# Altium schematic sheet BMS_Balancer.SchDoc
size A4
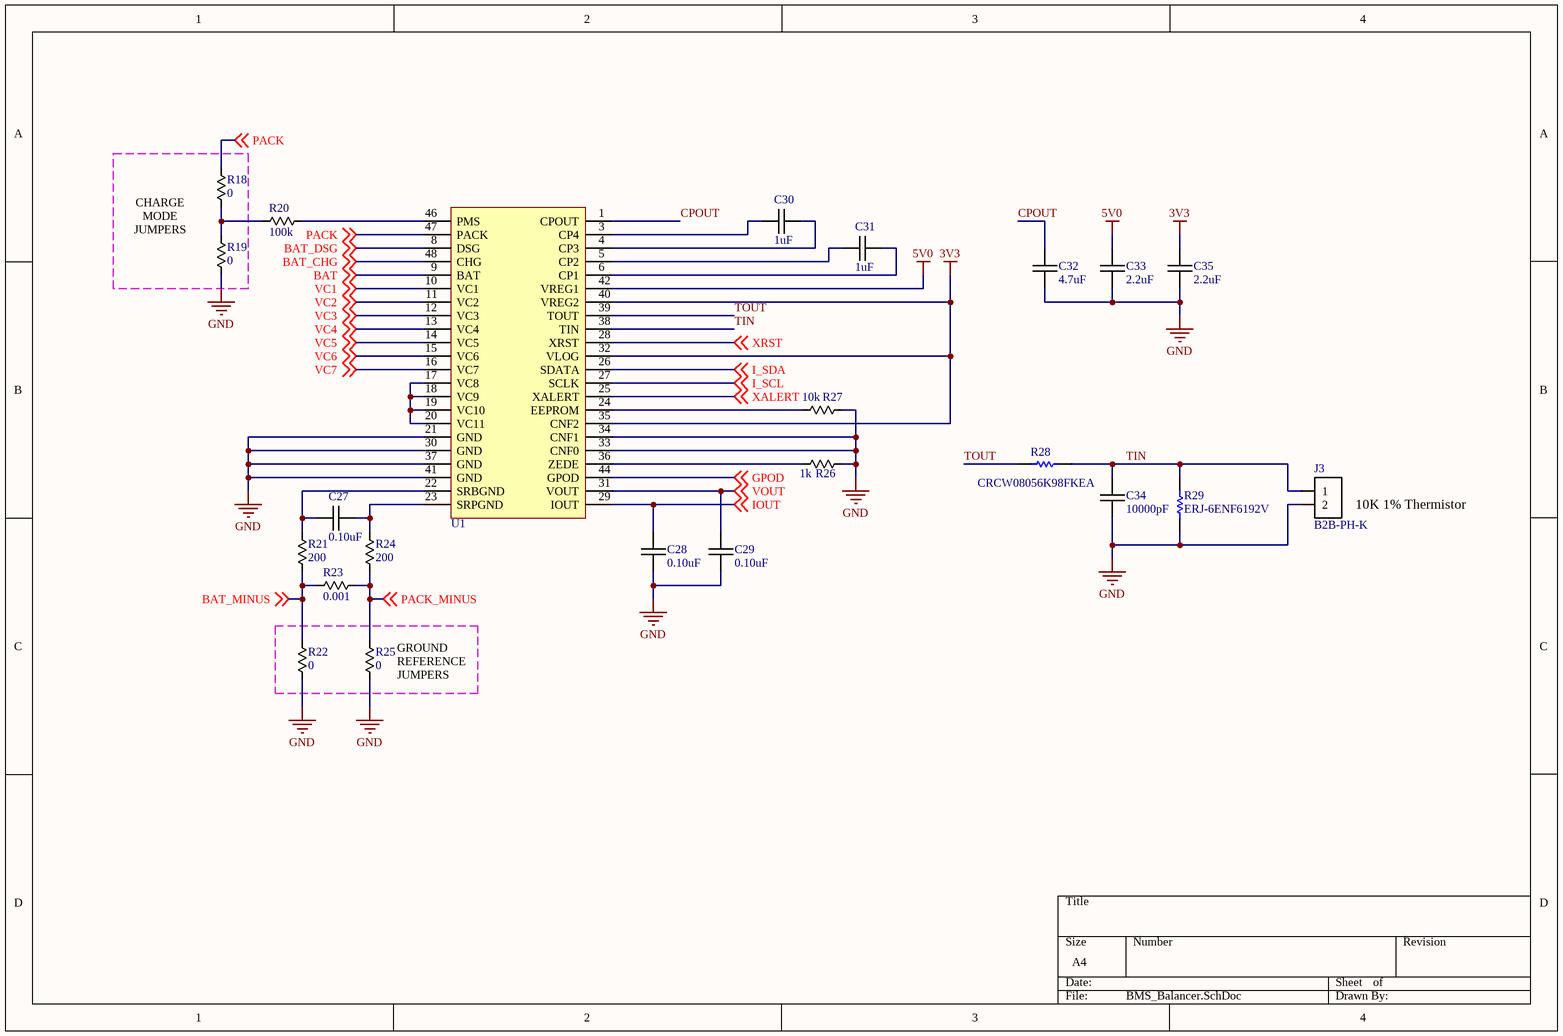
[diagram p0: BMS_Balancer.SchDoc]

## Parts
C27  0.10uF  [chip_0805]
C28  0.10uF  [chip_0805]
C29  0.10uF  [chip_0805]
C30  1uF  [chip_0805]
C31  1uF  [chip_0805]
C32  4.7uF  [chip_0805]
C33  2.2uF  [chip_1210]
C34  10000pF  [chip_0805]
C35  2.2uF  [chip_1210]
J3  B2B-PH-K  [JST_PHR_2_0]
R18  0  [chip_0805]
R19  0  [chip_0805]
R20  100k  [chip_0805]
R21  200  [chip_0805]
R22  0  [chip_0805]
R23  0.001  [chip_2512]
R24  200  [chip_0805]
R25  0  [chip_0805]
R26  1k  [chip_0805]
R27  10k  [chip_0805]
R28  CRCW08056K98FKEA  [RESC2013X50X30ML20T20]
R29  ERJ-6ENF6192V  [RESC2013X70X40ML20T20]
U1  BQ77PL900  [SSOP-48_0]  (value not drawn)

## Nets
3V3: C35.1 U1.32(VLOG) U1.35(CNF2) U1.40(VREG2)
5V0: C33.1 U1.42(VREG1)
GND: C28.2 C29.2 C32.1 C33.2 C34.2 C35.2 J3.2 R19.2 R22.2 R25.2 R26.2 R27.2 R29.1 U1.21(GND) U1.30(GND) U1.33(CNF0) U1.34(CNF1) U1.37(GND) U1.41(GND)
BAT: U1.9(BAT) ; off-sheet BAT
BAT_CHG: U1.48(CHG) ; off-sheet BAT_CHG
BAT_DSG: U1.8(DSG) ; off-sheet BAT_DSG
BAT_MINUS: R21.2 R22.1 R23.2 ; off-sheet BAT_MINUS
CPOUT: C32.2 U1.1(CPOUT)
GPOD: U1.44(GPOD) ; off-sheet GPOD
I_SCL: U1.27(SCLK) ; off-sheet I_SCL
I_SDA: U1.26(SDATA) ; off-sheet I_SDA
IOUT: C28.1 U1.29(IOUT) ; off-sheet IOUT
PACK: R18.1 U1.47(PACK) ; off-sheet PACK
PACK_MINUS: R23.1 R24.2 R25.1 ; off-sheet PACK_MINUS
TIN: C34.1 J3.1 R28.1 R29.2 U1.38(TIN)
TOUT: R28.2 U1.39(TOUT)
VC1: U1.10(VC1) ; off-sheet VC1
VC2: U1.11(VC2) ; off-sheet VC2
VC3: U1.12(VC3) ; off-sheet VC3
VC4: U1.13(VC4) ; off-sheet VC4
VC5: U1.14(VC5) ; off-sheet VC5
VC6: U1.15(VC6) ; off-sheet VC6
VC7: U1.16(VC7) ; off-sheet VC7
VOUT: C29.1 U1.31(VOUT) ; off-sheet VOUT
XALERT: U1.25(XALERT) ; off-sheet XALERT
XRST: U1.28(XRST) ; off-sheet XRST
NetC27_1: C27.1 R21.1 U1.22(SRBGND)
NetC27_2: C27.2 R24.1 U1.23(SRPGND)
NetC30_1: C30.1 U1.4(CP3)
NetC30_2: C30.2 U1.3(CP4)
NetC31_1: C31.1 U1.6(CP1)
NetC31_2: C31.2 U1.5(CP2)
NetR18_2: R18.2 R19.1 R20.1
NetR20_2: R20.2 U1.46(PMS)
NetR26_1: R26.1 U1.36(ZEDE)
NetR27_1: R27.1 U1.24(EEPROM)
NetU1_17: U1.17(VC8) U1.18(VC9) U1.19(VC10) U1.20(VC11)

Not connected (* = marked no-connect by the designer): U1 2(NC) 7(NC) 43(NC) 45(NC)

## Notes on the sheet
- CHARGE
  MODE
  JUMPERS
- (near J3) 10K 1% Thermistor
- (near R25) GROUND
  REFERENCE
  JUMPERS

## Library data of the parts
C27-C29 = CAP-00072: CAP, 0.10uF, 10%, 50V, X7R, 0805; Manufacturer: Murata; Manufacturer PN: GRM21BR71H104KA01K; Part Number: CAP-00072; Capacitance: 0.10uF; Tolerance: 10%; Voltage Rating: 50V; Type: X7R
C30 C31 = CAP-00109: CAP, 1uF, 10%, 50V, X7R, 0805; Manufacturer: Murata; Manufacturer PN: GRM21BR71H105KA12L; Part Number: CAP-00109; Capacitance: 1uF; Tolerance: 10%; Voltage Rating: 50V; Type: X7R
C32 = CAP-00128: CAP, 4.7uF, 10%, 25V, X7R, 0805; Manufacturer: Murata; Manufacturer PN: GRM21BR71E475KA73L; Part Number: CAP-00128; Capacitance: 4.7uF; Tolerance: 10%; Voltage Rating: 25V; Type: X7R
C33 C35 = CAP-00536: CAP, 2.2uF, ±20%, 100V, X7R, 0603; Manufacturer: TDK; Manufacturer PN: C3225X7R2A225M230AB; Part Number: CAP-00536; Capacitance: 2.2uF; Tolerance: ±20%; Voltage Rating: 100V; Type: X7R; Cost: $0.88
C34 = CAP-00045: CAP, 10000pF, 10%, 25V, X7R, 0805; Manufacturer: Murata; Manufacturer PN: GRM216R71E103KA01D; Part Number: CAP-00045; Capacitance: 10000pF; Tolerance: 10%; Voltage Rating: 25V; Type: X7R
J3 = CONN-00048: JST PH 2x1, THT, 2.00mm Pitch; Positions per level: 2; Levels: 1; Part Number: CONN-00048; Type: Header; Manufacturer: JST; Manufacturer PN: B2B-PH-K; Cost: 0.19
R18 R19 R22 R25 = RES-00720: RES SMD 0 OHM 1/8W 0805 Thick Film; Manufacturer: Stackpole; Manufacturer PN: RMCF0805ZT0R00; Tolerance: Jumper; Part Number: RES-00720; Resistance: 0; Power Rating: 1/8W; Cost: 0.1
R20 = RES-00302: RES SMD 100K OHM 1% 1/8W 0805; Manufacturer: Rohm Semiconductor; Manufacturer PN: KTR10EZPF1003; Power Rating: 0.125W; Part Number: RES-00302; Resistance: 100k; Tolerance: 1%
R21 R24 = RES-00197: RES SMD 200 OHM 1% 1/8W 0805; Manufacturer: Rohm Semiconductor; Manufacturer PN: KTR10EZPF2000; Power Rating: 0.125W; Part Number: RES-00197; Resistance: 200; Tolerance: 1%
R23 = RES-00002: RES, 0.001, 1%, 1W, 2512; Manufacturer: Yageo; Manufacturer PN: PA2512FKF070R001E; Part Number: RES-00002; Resistance: 0.001; Tolerance: 1%; Power Rating: 1W
R26 = RES-00361: RES SMD 1K OHM 1% 1/8W 0805; Manufacturer: Rohm Semiconductor; Manufacturer PN: KTR10EZPF1001; Power Rating: 0.125W; Part Number: RES-00361; Resistance: 1k; Tolerance: 1%
R27 = RES-00307: RES SMD 10K OHM 1% 1/8W 0805; Manufacturer: Rohm Semiconductor; Manufacturer PN: KTR10EZPF1002; Power Rating: 0.125W; Part Number: RES-00307; Resistance: 10k; Tolerance: 1%
R28 = CMP-2001-04091-1: Manufacturer: Vishay Dale; Part Number: CRCW08056K98FKEA
R29 = CMP-2001-00256-1: Manufacturer: Panasonic; Part Number: ERJ-6ENF6192V
U1 = PWREG-00024: Batt Manager, Li-Ion, 5-10 cells, bq77PL900; Manufacturer: TI; Manufacturer PN: BQ77PL900DLR; Voltage Range In: -0.3 - 60V; Reg Type: Batt Mngr; Fixed/Adj: Fixed; Part Number: PWREG-00024; Cost: 6.36